# Altium schematic sheet RP2040.SchDoc
size A4; SheetNumber: 1; SheetTotal: 1
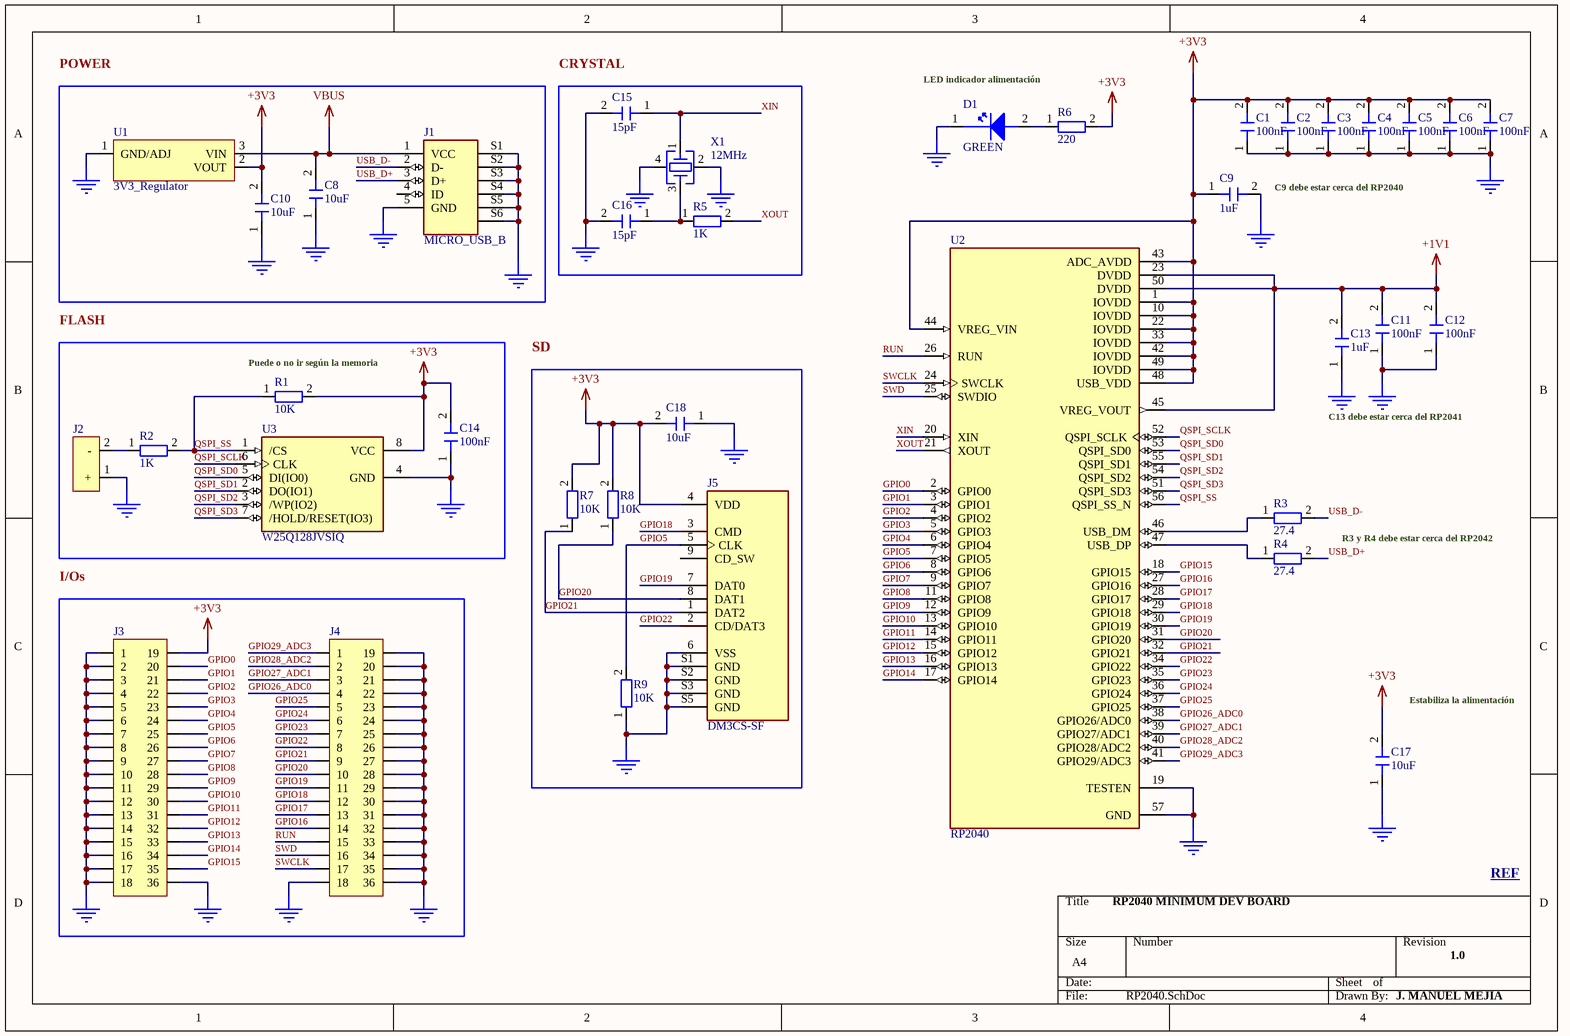
[diagram p0: RP2040.SchDoc]

## Parts
C1  100nF  [C0402]
C2  100nF  [C0402]
C3  100nF  [C0402]
C4  100nF  [C0402]
C5  100nF  [C0402]
C6  100nF  [C0402]
C7  100nF  [C0402]
C8  10uF  [C0603]
C9  1uF  [C0402]
C10  10uF  [C0603]
C11  100nF  [C0402]
C12  100nF  [C0402]
C13  1uF  [C0402]
C14  100nF  [C0402]
C15  15pF  [C0402]
C16  15pF  [C0402]
C17  10uF  [C0603]
C18  10uF  [C0603]
D1  GREEN  [LED0603_GREEN]
J1  MICRO_USB_B  [MICRO_USB_B]
J2  1x2 HEADER  [HEADER1X2]  (value not drawn)
J3  2X18 HEADER  [2X18 HEADER]  (value not drawn)
J4  2X18 HEADER  [2X18 HEADER]  (value not drawn)
J5  DM3CS-SF  [DM3CS-SF]
R1  10K  [R0402]
R2  1K  [R0402]
R3  27.4  [R0402]
R4  27.4  [R0402]
R5  1K  [R0402]
R6  220  [R0402]
R7  10K  [R0402]
R8  10K  [R0402]
R9  10K  [R0402]
U1  3V3_Regulator  [3V3_SOT223]
U2  RP2040  [RP2040]
U3  W25Q128JVSIQ  [W25Q128JVSIQ]
X1  12MHz  [ABM8G]

## Blocks framed on the sheet
POWER: C8 C10 J1 U1
CRYSTAL: C15 C16 R5 X1
FLASH: C14 J2 R1 R2 U3
SD: C18 J5 R7-R9
I/Os: J3 J4

## Nets
+1V1: C11.2 C12.2 C13.2 U2.23(DVDD) U2.45(VREG_VOUT) U2.50(DVDD)
+3V3: C1.2 C2.2 C3.2 C4.2 C5.2 C6.2 C7.2 C9.1 C10.2 C14.2 C17.2 C18.2 J3.19 J5.4(VDD) R1.2 R6.2 R7.2 R8.2 U1.2(VOUT) U2.1(IOVDD) U2.10(IOVDD) U2.22(IOVDD) U2.33(IOVDD) U2.42(IOVDD) U2.43(ADC_AVDD) U2.44(VREG_VIN) U2.48(USB_VDD) U2.49(IOVDD) U3.8(VCC)
GND: C1.1 C2.1 C3.1 C4.1 C5.1 C6.1 C7.1 C8.1 C9.2 C10.1 C11.1 C12.1 C13.1 C14.1 C15.2 C16.2 C17.1 C18.1 D1.1 J1.5(GND) J1.S1(SHIELD) J1.S2(SHIELD) J1.S3(SHIELD) J1.S4(SHIELD) J1.S5(SHIELD) J1.S6(SHIELD) J2.1(+) J3.1 J3.2 J3.3 J3.4 J3.5 J3.6 J3.7 J3.8 J3.9 J3.10 J3.11 J3.12 J3.13 J3.14 J3.15 J3.16 J3.17 J3.18 J3.36 J4.18 J4.19 J4.20 J4.21 J4.22 J4.23 J4.24 J4.25 J4.26 J4.27 J4.28 J4.29 J4.30 J4.31 J4.32 J4.33 J4.34 J4.35 J4.36 J5.6(VSS) J5.S1(GND) J5.S2(GND) J5.S3(GND) J5.S5(GND) R9.1 U1.1(GND/ADJ) U2.19(TESTEN) U2.57(GND) U3.4(GND) X1.2 X1.4
VBUS: C8.2 J1.1(VCC) U1.3(VIN)
GPIO0: J3.20 U2.2(GPIO0)
GPIO1: J3.21 U2.3(GPIO1)
GPIO2: J3.22 U2.4(GPIO2)
GPIO3: J3.23 U2.5(GPIO3)
GPIO4: J3.24 U2.6(GPIO4)
GPIO5: J3.25 J5.5(CLK) R9.2 U2.7(GPIO5)
GPIO6: J3.26 U2.8(GPIO6)
GPIO7: J3.27 U2.9(GPIO7)
GPIO8: J3.28 U2.11(GPIO8)
GPIO9: J3.29 U2.12(GPIO9)
GPIO10: J3.30 U2.13(GPIO10)
GPIO11: J3.31 U2.14(GPIO11)
GPIO12: J3.32 U2.15(GPIO12)
GPIO13: J3.33 U2.16(GPIO13)
GPIO14: J3.34 U2.17(GPIO14)
GPIO15: J3.35 U2.18(GPIO15)
GPIO16: J4.14 U2.27(GPIO16)
GPIO17: J4.13 U2.28(GPIO17)
GPIO18: J4.12 J5.3(CMD) U2.29(GPIO18)
GPIO19: J4.11 J5.7(DAT0) U2.30(GPIO19)
GPIO20: J4.10 J5.8(DAT1) R8.1 U2.31(GPIO20)
GPIO21: J4.9 J5.1(DAT2) R7.1 U2.32(GPIO21)
GPIO22: J4.8 J5.2(CD/DAT3) U2.34(GPIO22)
GPIO23: J4.7 U2.35(GPIO23)
GPIO24: J4.6 U2.36(GPIO24)
GPIO25: J4.5 U2.37(GPIO25)
GPIO26_ADC0: J4.4 U2.38(GPIO26/ADC0)
GPIO27_ADC1: J4.3 U2.39(GPIO27/ADC1)
GPIO28_ADC2: J4.2 U2.40(GPIO28/ADC2)
GPIO29_ADC3: J4.1 U2.41(GPIO29/ADC3)
QSPI_SCLK: U2.52(QSPI_SCLK) U3.6(CLK)
QSPI_SD0: U2.53(QSPI_SD0) U3.5(DI(IO0))
QSPI_SD1: U2.55(QSPI_SD1) U3.2(DO(IO1))
QSPI_SD2: U2.54(QSPI_SD2) U3.3(/WP(IO2))
QSPI_SD3: U2.51(QSPI_SD3) U3.7(/HOLD/RESET(IO3))
QSPI_SS: R1.1 R2.2 U2.56(QSPI_SS_N) U3.1(/CS)
RUN: J4.15 U2.26(RUN)
SWCLK: J4.17 U2.24(SWCLK)
SWD: J4.16 U2.25(SWDIO)
USB_D+: J1.3(D+) R4.2
USB_D-: J1.2(D-) R3.2
XIN: C15.1 U2.20(XIN) X1.1
XOUT: R5.2 U2.21(XOUT)
NetC16_1: C16.1 R5.1 X1.3
NetD1_2: D1.2 R6.1
NetJ2_2: J2.2(-) R2.1
NetR3_1: R3.1 U2.46(USB_DM)
NetR4_1: R4.1 U2.47(USB_DP)

Not connected (* = marked no-connect by the designer): J1 4(ID); J5 9(CD_SW)

## Notes on the sheet
- LED indicador alimentación
- C9 debe estar cerca del RP2040
- (near R1) Puede o no ir según la memoria
- C13 debe estar cerca del RP2041
- R3 y R4 debe estar cerca del RP2042
- (near C17) Estabiliza la alimentación
- RP2040 MINIMUM DEV BOARD
- REF <https://datasheets.raspberrypi.com/rp2040/hardware-design-with-rp2040.pdf>
- 1.0
- J. MANUEL MEJIA

## Library data of the parts
C1-C7 C9 C11-C16 = CAP0402: CAP CER 50V X7R 0402
C8 C10 C17 C18 = CAP0603: CAP CER 50V X7R 0603
D1 = LED0603: LED GREEN CLEAR CHIP 0603 SMD; Manufacturer: Visual Communications; Manufacturer Part Number: LSM0603453V; Lens Color: Colorless; Lens Style: Flat; Luminous Intensity: 63mcd; Forward Voltage: 2V; Test Current: 20mA; Viewing Angle: 120°; Dominant Wavelength: 572nm; Power Dissipation: 60mW; Reverse Voltage: 5V; Wavelength: 576nm; Lens Size: 0.8mm; Supplier: Digi-Key; Supplier Part Number: LSM0603453VCT-ND; RoHS: Yes; Category: LEDs; Stock: 93850; Pricing: 1=0.46, 10=0.283, 100=0.1626, 1000=0.12726, 2000=0.11666 (USD); Mounting Technology: Surface Mount; Case/Package: 0603; Color: Green; Case Code (Imperial): 0603; Case Code (Metric): 1608; Min Operating Temperature: -40°C; Max Operating Temperature: 85°C; Packaging: Cut Tape; Lens Transparency: Clear; Series: LSM0603; Forward Current: 20mA; Length: 1.6mm; Width: 0.8mm; Height: 0.65mm; RoHS Compliant: Yes; ComponentLink1URL: http://www.farnell.com/datasheets/2699708.pdf?src-supplier=Farnell; ComponentLink1Description: http://www.farnell.com/datasheets/2699708.pdf?src-supplier=Farnell; ComponentLink2URL: http://www.farnell.com/datasheets/2699708.pdf?src-supplier=Newark; ComponentLink2Description: http://www.farnell.com/datasheets/2699708.pdf?src-supplier=Newark; ComponentLink3URL: https://vcclite.com/wp-content/uploads/wpallimport/files/files/LSM0603453V.pdf?src-supplier=Digi-Key; ComponentLink3Description: https://vcclite.com/wp-content/uploads/wpallimport/files/files/LSM0603453V.pdf?src-supplier=Digi-Key
J1 = MICRO_USB_B: CONN RCPT USB2.0 MICRO B SMD R/A
J2 = 22-27-2021: CONN HEADER VERT 2POS 2.54MM; Manufacturer: Molex; Plating: 154ConductorMaterial; Number of Positions: 2; Current Rating: 4A; Voltage Rating: 500V; Gender: Male; Voltage Rating (DC): 250V; Supplier: Digi-Key; Supplier Part Number: WM4111-ND; Manufacturer Part Number: 22-27-2021; RoHS: Yes; Category: Headers and Wire Housings; Stock: 89345; Pricing: 1=0.3, 10=0.245, 100=0.18, 1000=0.14317, 5000=0.12272, 10000=0.11453 (USD); Contact Plating: Tin; Contact Material: Tin; Housing Color: Natural; Housing Material: Nylon; Material: Nylon; Weight: 0.00769oz; Number of Rows: 1; Packaging: Bulk; Termination: Through Hole; Series: 6410; Package Quantity: 24000; Contact Gender: Male; Contact Type: -; Pitch: 2.54mm; RoHS Compliant: Yes; Lead Free: Lead Free; Flammability Rating: UL94 V-0; Reach SVHC Compliant: 4187SVHC
J3 J4 = 2X18 HEADER: 2X18 2.54 MALE HEADER
J5 = DM3CS-SF: CONN MICRO SD CARD HINGED TYPE; Manufacturer: Hirose; Contact Resistance: 100mR; Current Rating: 500mA; Voltage Rating (AC): 125V; Gender: Female; Connector Type: Connector; Number of Contacts: 8; Insulation Resistance: 1GR; Pitch: 1.1mm; Description: Connector, Memory, Micro Sd, Hinged Rohs Compliant: Yes |Hirose(Hrs) DM3CS-SF; Supplier: Digikey; Supplier Part Number: HR1972CT-ND; Manufacturer Part Number: DM3CS-SF; RoHS: Yes; Category: Memory Connectors; Stock: 24121; Pricing: 1=1.55, 10=1.353, 25=1.2952, 50=1.2666, 100=1.209, 250=1.09384, 500=1.00748 (USD); Mounting Technology: Surface Mount; Contact Material: Gold,Copper Alloy,Copper; Contact Plating: Gold; Housing Material: Polymer; Housing Color: 46Colour; Min Operating Temperature: -25°C; Max Operating Temperature: 85°C; Packaging: Tape and Reel; Number of Rows: 1; Max Current Rating: 500mA; Termination: Solder; Number of Positions: 8; Orientation: Right Angle; Series: DM3; Contact Voltage Rating (AC): 125V; Voltage Rating: 125V; Length: 14.1mm; Width: 13.8mm; Depth: 1.83mm; Contact Pitch: 1.1mm; Radiation Hardening: No; Flammability Rating: UL94 V-0; RoHS Compliant: Yes; Reach SVHC Compliant: Unknown; Lead Free: 5697LeadFree; ComponentLink1URL: https://datasheet.ciiva.com/683/e60900232-683360.pdf?src-supplier=Digikey; ComponentLink1Description: https://datasheet.ciiva.com/683/e60900232-683360.pdf?src-supplier=Digikey; ComponentLink2URL: https://datasheet.ciiva.com/7651/1465328-7651895.pdf?src-supplier=Element14; ComponentLink2Description: https://datasheet.ciiva.com/7651/1465328-7651895.pdf?src-supplier=Element14; ComponentLink3URL: https://datasheet.ciiva.com/4581/e60900232-38395-4581034.pdf?src-supplier=Mouser; ComponentLink3Description: https://datasheet.ciiva.com/4581/e60900232-38395-4581034.pdf?src-supplier=Mouser; ComponentLink4URL: https://datasheet.ciiva.com/3122/e60900232-3122536.pdf?src-supplier=Avnet; ComponentLink4Description: https://datasheet.ciiva.com/3122/e60900232-3122536.pdf?src-supplier=Avnet; ComponentLink5URL: https://datasheet.ciiva.com/16434/e60900232-16434058.pdf?src-supplier=Future+Electronics; ComponentLink5Description: https://datasheet.ciiva.com/16434/e60900232-16434058.pdf?src-supplier=Future+Electronics; ComponentLink6URL: https://datasheet.ciiva.com/683/e60900232-683361.pdf?src-supplier=Digikey; ComponentLink6Description: https://datasheet.ciiva.com/683/e60900232-683361.pdf?src-supplier=Digikey; ComponentLink7URL: https://datasheet.ciiva.com/683/e60900232-683359.pdf?src-supplier=Digikey; ComponentLink7Description: https://datasheet.ciiva.com/683/e60900232-683359.pdf?src-supplier=Digikey
R1-R9 = RES0402: RES 5% 1/16W 0402
U1 = 3V3_Regulator: IC REG LINEAR 3.3V 1A SOT223
U2 = RP2040: IC MCU 32BIT EXT MEM 56QFN; MF: Raspberry Pi; MP: SC0914(13); SnapEDA_Link: https://www.snapeda.com/parts/SC0914(13)/Raspberry+Pi/view-part/?ref=snap; Package: VFQFN-56 Raspberry Pi; Value: *; Check_prices: https://www.snapeda.com/parts/SC0914(13)/Raspberry+Pi/view-part/?ref=eda
U3 = W25Q128JVSIQ: IC FLASH 128MBIT SPI/QUAD 8SOIC; Manufacturer: Winbond; Memory Format: Non-Volatile,FLASH; Frequency: 133MHz; Memory Size: 128Mb; Supplier: Digikey; Supplier Part Number: W25Q128JVSIQ-ND; Manufacturer Part Number: W25Q128JVSIQ; RoHS: Yes; Category: Flash; Stock: 93739; Pricing: 1=1.73, 10=1.578, 25=1.5352, 90=1.36544, 270=1.36144, 540=1.34091, 1080=1.28398, 5040=1.19543 (USD); Mounting Technology: Surface Mount; Case/Package: SOIC; Min Operating Temperature: -40°C; Max Operating Temperature: 85°C; Packaging: Tray; Series: SpiFlash®; RoHS Compliant: Yes; ComponentLink1URL: http://www.winbond.com/resource-files/w25q128jv%20revf%2003272018%20plus.pdf?src-supplier=Digikey; ComponentLink1Description: http://www.winbond.com/resource-files/w25q128jv%20revf%2003272018%20plus.pdf?src-supplier=Digikey
X1 = ABM8G: CRYSTAL 12.0000MHZ 10PF SMD